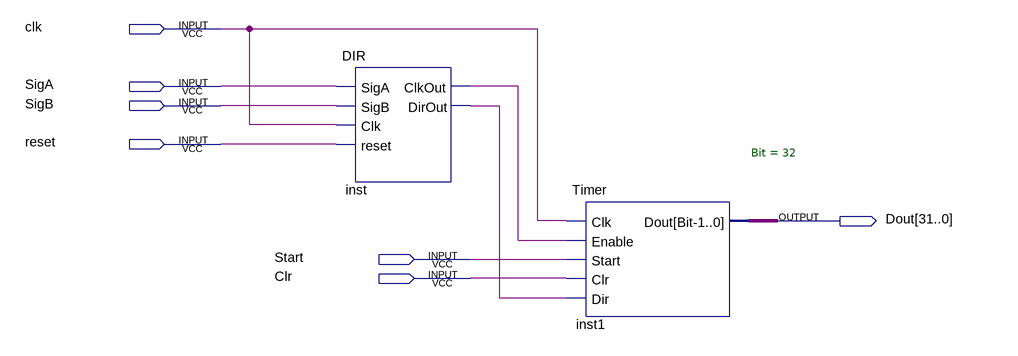
[diagram p0: schematic sheet]
// Quartus schematic testqep.bdf as structural Verilog: 2 symbols, 7 pins
module testqep (
  input  clk,
  input  SigA,
  input  SigB,
  input  reset,
  input  Start,
  input  Clr,
  output [31:0] Dout
);

  wire inst_clkout, inst_dirout;

  DIR inst (.SigA(SigA), .SigB(SigB), .Clk(clk), .reset(reset), .ClkOut(inst_clkout), .DirOut(inst_dirout));
  Timer #(.Bit(32)) inst1 (.Clk(clk), .Enable(inst_clkout), .Start(Start), .Clr(Clr), .Dir(inst_dirout), .Dout(Dout));
endmodule
